# EAGLE design ShootingBoard (EAGLE 6.3)
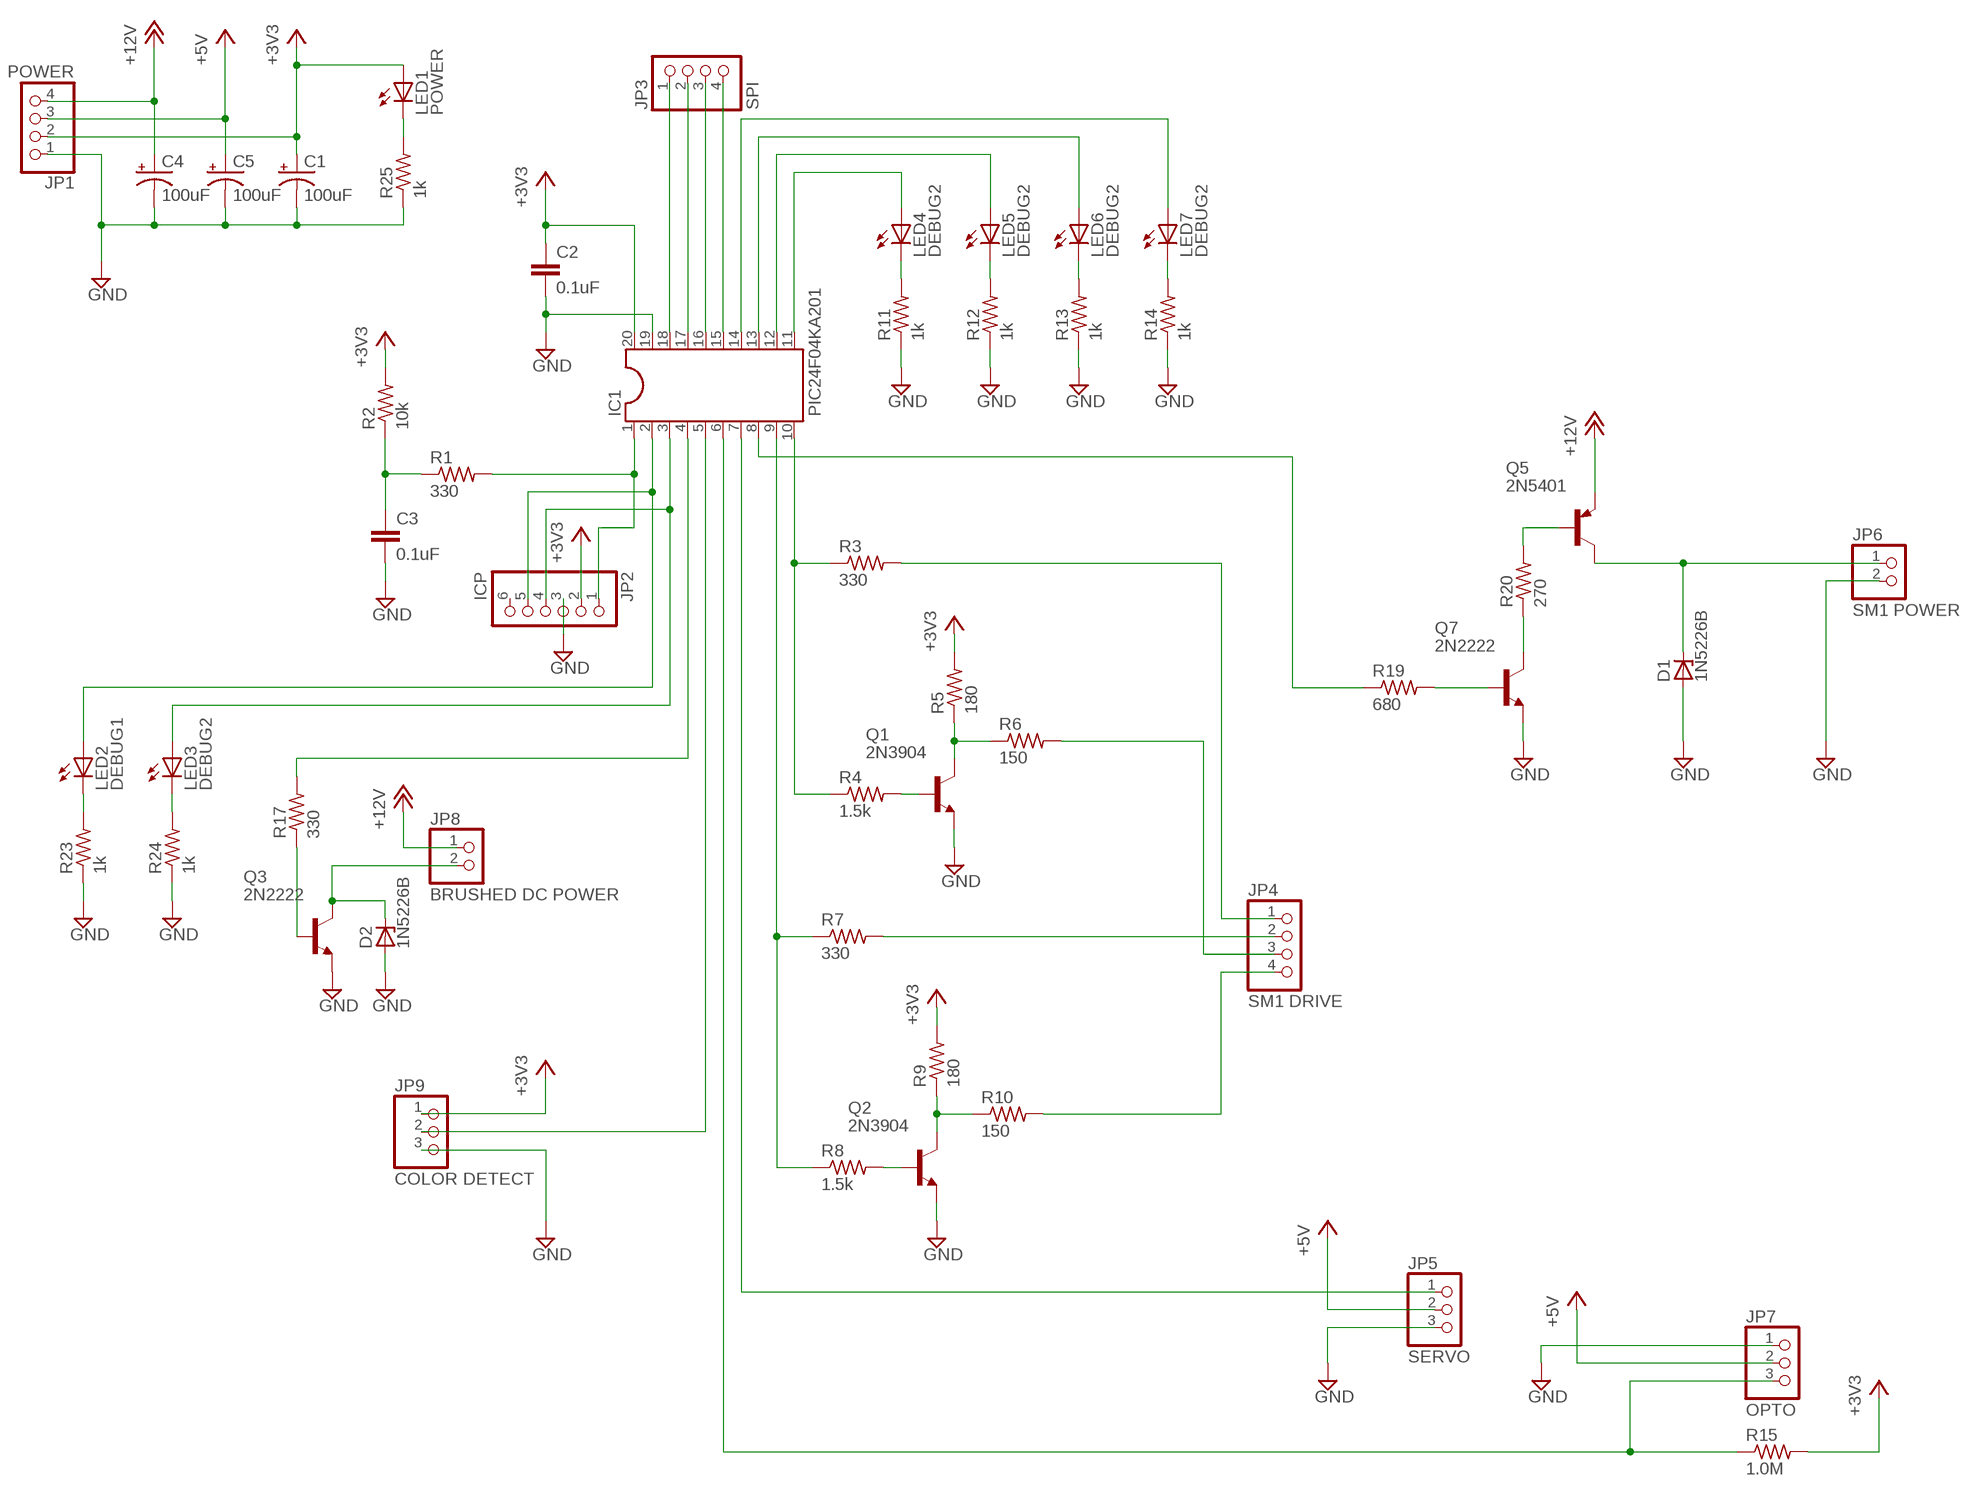
[diagram p0: schematic, sheet 1]

## Parts
C1  100uF  CPOL-USE2.5-7  [E2,5-7]
C2  0.1uF  C-EUC0805  [C0805]
C3  0.1uF  C-EUC0805  [C0805]
C4  100uF  CPOL-USE2.5-7  [E2,5-7]
C5  100uF  CPOL-USE2.5-7  [E2,5-7]
D1  1N5226B  ZPD  [DO35Z10]
D2  1N5226B  ZPD  [DO35Z10]
IC1  PIC24F04KA201  DIL20S  [SOCKET-20]
JP1  POWER  PINHD-1X4  [1X04]
JP2  ICP  PINHD-1X6  [1X06]
JP3  SPI  PINHD-1X4  [1X04]
JP4  SM1 DRIVE  PINHD-1X4  [1X04]
JP5  SERVO  PINHD-1X3  [1X03]
JP6  SM1 POWER  PINHD-1X2  [1X02]
JP7  OPTO  PINHD-1X3  [1X03]
JP8  BRUSHED DC POWER  PINHD-1X2  [1X02]
JP9  COLOR DETECT  PINHD-1X3  [1X03]
LED1  POWER  LED3MM  [LED3MM]
LED2  DEBUG1  LED3MM  [LED3MM]
LED3  DEBUG2  LED3MM  [LED3MM]
LED4  DEBUG2  LED3MM  [LED3MM]
LED5  DEBUG2  LED3MM  [LED3MM]
LED6  DEBUG2  LED3MM  [LED3MM]
LED7  DEBUG2  LED3MM  [LED3MM]
Q1  2N3904  [TO92]
Q2  2N3904  [TO92]
Q3  2N2222  2N3904  [TO92]
Q5  2N5401  2N3906  [TO92]
Q7  2N2222  2N3904  [TO92]
R1  330  R-US_R0805  [R0805]
R2  10k  R-US_R0805  [R0805]
R3  330  R-US_R0805  [R0805]
R4  1.5k  R-US_R0805  [R0805]
R5  180  R-US_R0805  [R0805]
R6  150  R-US_R0805  [R0805]
R7  330  R-US_R0805  [R0805]
R8  1.5k  R-US_R0805  [R0805]
R9  180  R-US_R0805  [R0805]
R10  150  R-US_R0805  [R0805]
R11  1k  R-US_R0805  [R0805]
R12  1k  R-US_R0805  [R0805]
R13  1k  R-US_R0805  [R0805]
R14  1k  R-US_R0805  [R0805]
R15  1.0M  R-US_R0805  [R0805]
R17  330  R-US_R0805  [R0805]
R19  680  R-US_R0805  [R0805]
R20  270  R-US_R0805  [R0805]
R23  1k  R-US_R0805  [R0805]
R24  1k  R-US_R0805  [R0805]
R25  1k  R-US_R0805  [R0805]

## Nets
+3V3: C1.+ C2.1 IC1.20 JP1.2 JP2.2 JP9.1 LED1.A R2.2 R5.2 R9.2 R15.2
+5V: C5.+ JP1.3 JP5.2 JP7.2
+12V: C4.+ JP1.4 JP8.1 Q5.3(E)
GND: C1.- C2.2 C3.2 C4.- C5.- D1.A D2.A IC1.19 JP1.1 JP2.3 JP5.3 JP6.2 JP7.1 JP9.3 Q1.3(E) Q2.3(E) Q3.3(E) Q7.3(E) R11.1 R12.1 R13.1 R14.1 R23.1 R24.1 R25.1
N$1: IC1.1 JP2.1 R1.2
N$2: C3.1 R1.1 R2.1
N$3: IC1.2 JP2.5 LED2.A
N$4: IC1.3 JP2.4 LED3.A
N$5: IC1.10 R3.1 R4.1
N$6: Q1.1(C) R5.1 R6.1
N$7: Q1.2(B) R4.2
N$8: IC1.9 R7.1 R8.1
N$9: Q2.1(C) R9.1 R10.1
N$10: Q2.2(B) R8.2
N$11: IC1.11 LED4.A
N$12: LED4.K(C) R11.2
N$13: IC1.12 LED5.A
N$14: LED5.K(C) R12.2
N$15: IC1.13 LED6.A
N$16: LED6.K(C) R13.2
N$17: JP4.1 R3.2
N$18: JP4.2 R7.2
N$19: JP4.3 R6.2
N$20: JP4.4 R10.2
N$21: IC1.14 LED7.A
N$22: LED7.K(C) R14.2
N$23: IC1.6 JP7.3 R15.1
N$24: IC1.5 JP9.2
N$25: IC1.4 R17.2
N$26: Q7.1(C) R20.1
N$27: Q5.2(B) R20.2
N$28: D1.C JP6.1 Q5.1(C)
N$29: D2.C JP8.2 Q3.1(C)
N$30: IC1.7 JP5.1
N$31: Q7.2(B) R19.2
N$32: Q3.2(B) R17.1
N$33: IC1.8 R19.1
N$34: IC1.18 JP3.1
N$35: IC1.17 JP3.2
N$36: IC1.16 JP3.3
N$37: IC1.15 JP3.4
N$38: LED2.K(C) R23.2
N$39: LED3.K(C) R24.2
N$40: LED1.K(C) R25.2
Unconnected: JP2.6

## Library data of the parts
C1 C4 C5 = rcl:CPOL-US: POLARIZED CAPACITOR, American symbol
C2 C3 = rcl:C-EU: CAPACITOR, European symbol
D1 D2 = diode:ZPD: Z DIODE 500 mW
IC1 = ic-package:DIL20: Dual In Line / Socket
JP1 JP3 JP4 = pinhead:PINHD-1X4: PIN HEADER
JP2 = pinhead:PINHD-1X6: PIN HEADER
JP5 JP7 JP9 = pinhead:PINHD-1X3: PIN HEADER
JP6 JP8 = pinhead:PINHD-1X2: PIN HEADER
LED1-LED7 = led:LED: LED OSRAM: - CHIPLED LG R971, LG N971, LY N971, LG Q971, LY Q971, LO R971, LY R971 LH N974, LH R974 LS Q976, LO Q976, LY Q976 LO Q996 - Hyper CHIPLED LW Q18S LB Q993, LB Q99A, LB R99A - SideLED LS A670, LO A670, LY A670, LG A670, LP A670 LB A673, LV A673, LT A673, LW A673 LH A674 LY A675 LS A676, LA A676, LO A676, LY A676, LW A676 LS A679, LY A679, LG A679 - Hyper Micro SIDELED® LS Y876, LA Y876, LO Y876, LY Y876 LT Y87S - SmartLED LW L88C, LW L88S LB L89C, LB L89S, LG L890 LS L89K, LO L89K, LY L89K LS L896, LA L896, LO L896, LY L896 - TOPLED LS T670, LO T670, LY T670, LG T670, LP T670 LSG T670, LSP T670, LSY T670, LOP T670, LYG T670 LG T671, LOG T671, LSG T671 LB T673, LV T673, LT T673, LW T673 LH T674 LS T676, LA T676, LO T676, LY T676, LB T676, LH T676, LSB T676, LW T676 LB T67C, LV T67C, LT T67C, LS T67K, LO T67K, LY T67K, LW E67C LS E67B, LA E67B, LO E67B, LY E67B, LB E67C, LV E67C, LT E67C LW T67C LS T679, LY T679, LG T679 LS T770, LO T770, LY T770, LG T770, LP T770 LB T773, LV T773, LT T773, LW T773 LH T774 LS E675, LA E675, LY E675, LS T675 LS T776, LA T776, LO T776, LY T776, LB T776 LHGB T686 LT T68C, LB T68C - Hyper Mini TOPLED® LB M676 - Mini TOPLED Santana® LG M470 LS M47K, LO M47K, LY M47K Source: http://www.osram.convergy.de LUXEON: - LUMILED® LXK2-PW12-R00, LXK2-PW12-S00, LXK2-PW14-U00, LXK2-PW14-V00 LXK2-PM12-R00, LXK2-PM12-S00, LXK2-PM14-U00 LXK2-PE12-Q00, LXK2-PE12-R00, LXK2-PE12-S00, LXK2-PE14-T00, LXK2-PE14-U00 LXK2-PB12-K00, LXK2-PB12-L00, LXK2-PB12-M00, LXK2-PB14-N00, LXK2-PB14-P00, LXK2-PB14-Q00 LXK2-PR12-L00, LXK2-PR12-M00, LXK2-PR14-Q00, LXK2-PR14-R00 LXK2-PD12-Q00, LXK2-PD12-R00, LXK2-PD12-S00 LXK2-PH12-R00, LXK2-PH12-S00 LXK2-PL12-P00, LXK2-PL12-Q00, LXK2-PL12-R00 Source: www.luxeon.com KINGBRIGHT: KA-3528ASYC Source: www.kingbright.com
Q1-Q3 Q7 = transistor-npn:2N3904: NPN Transistor
Q5 = transistor-pnp:2N3906: PNP Transistor
R1-R15 R17 R19 R20 R23-R25 = rcl:R-US_: RESISTOR, American symbol

## Board
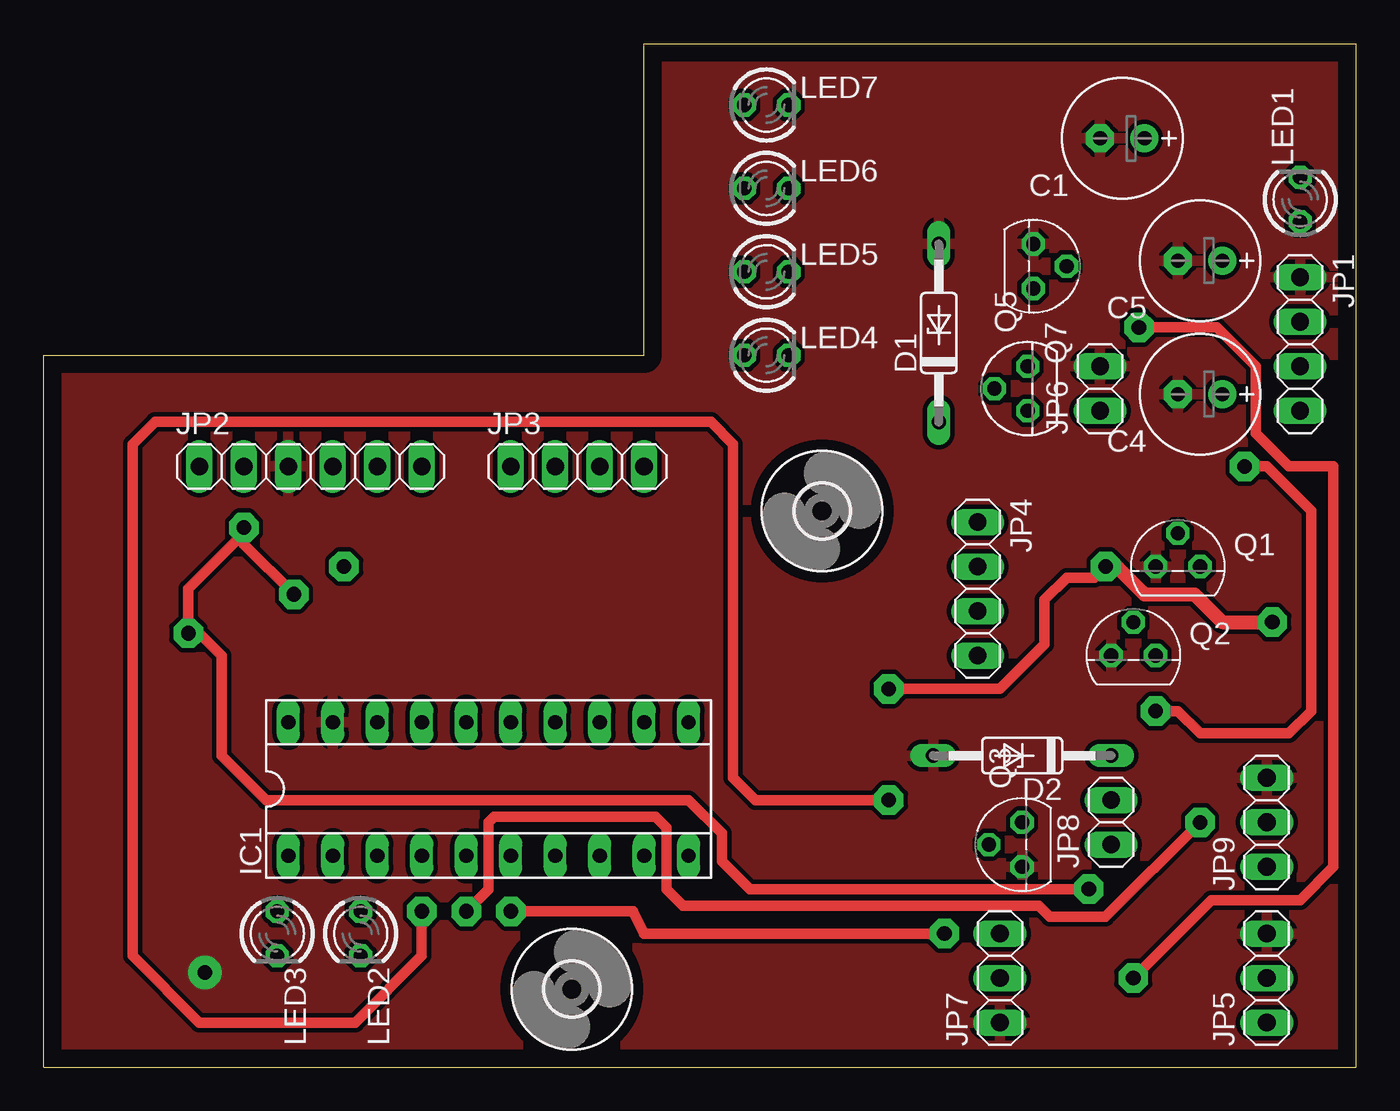
[diagram p1: board, top side]
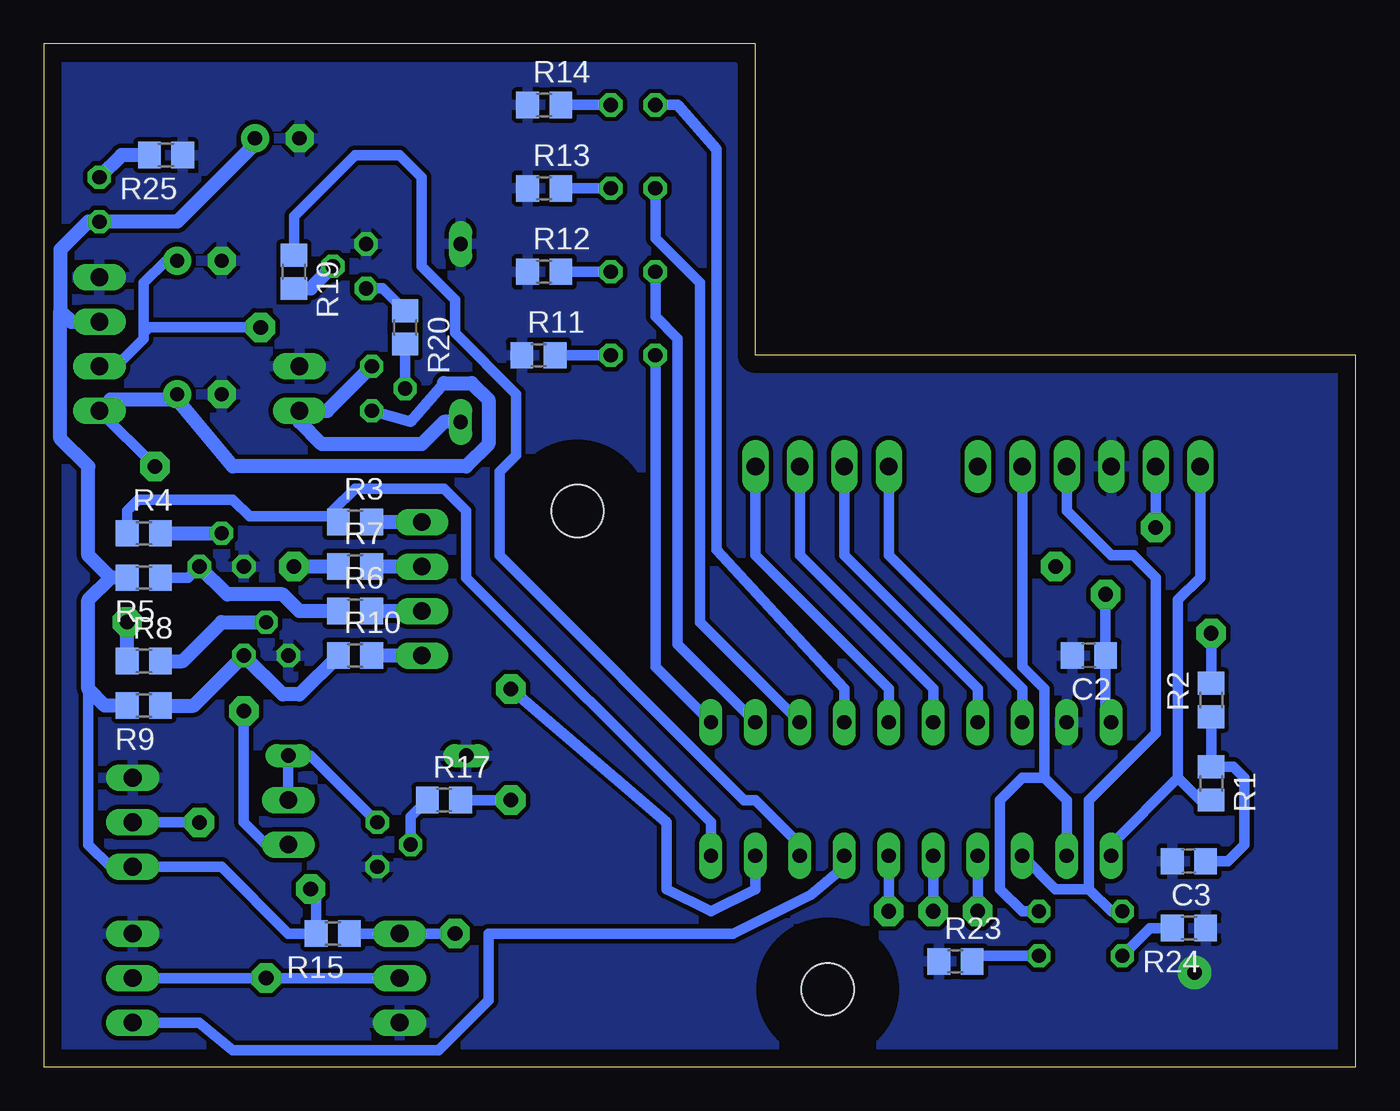
[diagram p2: board, bottom side, seen from below]

Size 74.93 x 58.42 mm. Coordinates in mm from the lower left corner, seen from the top.
Outline: 0,0 74.93,0 74.93,58.42 34.29,58.42 34.29,40.64 0,40.64 0,0
Copper layers (1*16): Top 0.035mm / dielectric 1.5mm / Bottom 0.035mm
Design rules "default *": minimum track width 10mil, minimum drill 24mil, track to track 10mil, track to pad 10mil, pad to pad 10mil, via to via 10mil, smd to smd 8mil, copper to edge 40mil, drill to drill 8mil, minimum pad ring 10mil, minimum via ring 8mil, stop-mask expansion 4mil, vias tented up to drill 0mil, thermal gap 10mil

### Footprints (pad centres in the part's own frame; a part is rotated, then mirrored left to right if it is on the bottom)
E2,5-7 = drill 0.813 pad 1.6: + -1.27,0 | drill 0.813 pad 1.6 octagon: - 1.27,0
C0805 = smd 1.3 x 1.5: 1 -0.95,0; 2 0.95,0
DO35Z10 = drill 0.813 long: A 5.08,0; C -5.08,0
SOCKET-20 = drill 0.813 long: 1 -11.43,-3.81; 2 -8.89,-3.81; 3 -6.35,-3.81; 4 -3.81,-3.81; 5 -1.27,-3.81; 6 1.27,-3.81; 7 3.81,-3.81; 8 6.35,-3.81; 9 8.89,-3.81; 10 11.43,-3.81; 11 11.43,3.81; 12 8.89,3.81; 13 6.35,3.81; 14 3.81,3.81; 15 1.27,3.81; 16 -1.27,3.81; 17 -3.81,3.81; 18 -6.35,3.81; 19 -8.89,3.81; 20 -11.43,3.81
1X04 = drill 1.016 long: 1 -3.81,0; 2 -1.27,0; 3 1.27,0; 4 3.81,0
1X06 = drill 1.016 long: 1 -6.35,0; 2 -3.81,0; 3 -1.27,0; 4 1.27,0; 5 3.81,0; 6 6.35,0
1X03 = drill 1.016 long: 1 -2.54,0; 2 0,0; 3 2.54,0
1X02 = drill 1.016 long: 1 -1.27,0; 2 1.27,0
LED3MM = drill 0.813 octagon: A -1.27,0; K 1.27,0
TO92 = drill 0.813 octagon: 1 1.27,0; 2 0,1.905; 3 -1.27,0
R0805 = smd 1.3 x 1.5: 1 -0.95,0; 2 0.95,0
3,0 = hole 3: 0,0

### Placement (x,y rotation side)
C1  61.59,53.02 180 top
C2  15.24,23.5 180 bottom
C3  9.53,11.75 180 bottom
C4  66.04,38.42 180 top
C5  66.04,46.04 180 top
D1  51.12,41.91 90 top
D2  55.88,17.78 180 top
IC1  25.4,15.88 0 top
JP1  71.75,41.27 270 top
JP2  15.24,34.29 0 top
JP3  30.48,34.29 0 top
JP4  53.34,27.3 270 top
JP5  69.85,5.08 90 top
JP6  60.33,38.73 90 top
JP7  54.61,5.08 90 top
JP8  60.96,13.97 90 top
JP9  69.85,13.97 90 top
LED1  71.75,49.53 90 top
LED2  18.1,7.62 270 top
LED3  13.34,7.62 270 top
LED4  41.27,40.64 0 top
LED5  41.27,45.4 0 top
LED6  41.27,50.16 0 top
LED7  41.27,54.93 0 top
Q1  64.77,28.57 0 top
Q2  62.23,23.5 0 top
Q3  55.88,12.7 90 top
Q5  56.2,38.73 90 top
Q7  56.52,45.72 270 top
R1  8.26,16.19 270 bottom
R2  8.26,20.95 90 bottom
R3  57.15,31.11 0 bottom
R4  69.22,30.48 0 bottom
R5  69.22,27.94 180 bottom
R6  57.15,26.04 0 bottom
R7  57.15,28.57 0 bottom
R8  69.22,23.18 0 bottom
R9  69.22,20.64 180 bottom
R10  57.15,23.5 0 bottom
R11  46.67,40.64 0 bottom
R12  46.35,45.4 0 bottom
R13  46.35,50.16 0 bottom
R14  46.35,54.93 0 bottom
R15  58.42,7.62 180 bottom
R17  52.07,15.24 0 bottom
R19  60.64,45.4 270 bottom
R20  54.29,42.23 270 bottom
R23  22.86,6.03 0 bottom
R24  9.53,7.94 180 bottom
R25  67.94,52.07 180 bottom
U$1  [3,0]  44.45,31.75 0 top
U$2  [3,0]  30.16,4.45 0 top

### Tracks (layer width: path | path; a pad name or v marks a point on that pad's centre or on a via)
+3V3  (via drill 0.84 pad 1.68)
  Top 0.61: v11.43,30.8 11.43,30.48 | 11.43,30.48 11.43,29.84 v14.29,26.99 | v8.26,24.77 8.26,25.4 | 8.26,25.4 8.26,27.3 11.43,30.48 | v59.69,10.16 40.32,10.16 38.73,11.75 38.73,13.34 36.83,15.24 12.7,15.24 10.16,17.78 10.16,23.5 8.26,25.4
  Bottom 0.61: JP2.2 v11.43,30.8 | IC1.20 14.29,20 C2.1 v14.29,26.99 | 72.39,21.59 72.39,12.7 71.12,11.43 JP9.1 64.77,11.43 60.96,7.62 R15.2 59.37,9.84 v59.69,10.16 | R2.2 v8.26,24.77
  Bottom 0.813: C1.+ 62.87,52.7 67.31,48.26 LED1.A 72.39,48.26 73.98,46.67 73.98,43.18 | 73.98,43.18 73.34,42.55 JP1.2 | R9.2 71.44,20.64 72.39,21.59 72.39,26.67 71.12,27.94 | R5.2 71.12,27.94 | 71.12,27.94 72.39,29.21 72.39,34.29 73.98,35.88 73.98,43.18
+5V  (via drill 0.84 pad 1.68)
  Top 0.61: v62.55,42.23 66.99,42.23 69.22,40.01 69.22,36.2 71.12,34.29 73.66,34.29 73.66,11.43 71.75,9.53 66.67,9.53 v62.23,5.08
  Bottom 0.61: C5.+ 67.94,46.04 69.22,44.77 69.22,41.91 | 69.22,41.91 69.22,41.59 70.8,40.01 | v62.55,42.23 68.9,42.23 69.22,41.91 | JP7.2 v62.23,5.08 JP5.2
  Bottom 0.813: 70.8,40.01 JP1.3
+12V  (via drill 0.84 pad 1.68)
  Top 0.61: v63.5,20.32 64.77,20.32 66.04,19.05 71.12,19.05 72.39,20.32 72.39,31.75 69.85,34.29 v68.58,34.29
  Bottom 0.61: Q5.3 53.98,36.83 52.07,39.05 | JP8.1 62.23,12.7 63.5,13.97 v63.5,20.32 | JP1.4 v68.58,34.29
  Bottom 0.813: 52.07,39.05 50.48,39.05 49.53,38.1 49.53,35.56 50.8,34.29 64.14,34.29 67.31,38.1 | C4.+ 67.31,38.1 | 67.31,38.1 71.12,38.1 JP1.4
GND  (via drill 0.84 pad 1.93)
  other vias: 9.21,5.4
  pour Bottom: 0,40.64 0,0 76.2,0 76.2,57.15 35.56,57.15 35.56,40.64
  pour Top: -2.54,41.91 -2.54,-3.81 78.74,-3.81 78.74,58.42 33.02,58.42 33.02,41.91
N$1
  Bottom 0.61: JP2.1 8.89,27.94 10.16,26.67 10.16,16.51 | 10.16,16.51 8.89,15.24 R1.2 | IC1.1 13.97,12.7 10.16,16.51
N$2
  Bottom 0.61: R2.1 R1.1 6.99,17.14 6.35,16.51 6.35,12.7 7.3,11.75 C3.1
N$3
  Bottom 0.61: IC1.2 16.51,15.24 17.78,16.51 | 17.78,16.51 19.05,16.51 20.32,15.24 20.32,10.16 19.05,8.89 LED2.A | JP2.5 19.05,22.86 17.78,21.59 17.78,16.51
N$4
  Bottom 0.61: JP2.4 16.51,31.75 13.97,29.21 12.7,29.21 11.43,27.94 11.43,19.05 15.24,15.24 15.24,10.16 | 15.24,10.16 13.97,8.89 LED3.A | IC1.3 17.14,10.16 15.24,10.16
N$5
  Bottom 0.61: IC1.10 36.83,13.97 50.8,27.94 50.8,31.75 52.07,33.02 57.15,33.02 58.42,31.75 58.42,31.43 | 58.42,31.43 R3.1 | 58.42,31.43 63.19,31.43 64.14,32.38 69.53,32.38 70.17,31.75 R4.1
N$6
  Bottom 0.61: R5.1 66.67,27.94 Q1.1
  Bottom 0.813: R6.1 60.33,26.04 61.28,26.99 64.45,26.99 Q1.1
N$7
  Bottom 0.813: R4.2 Q1.2
N$8  (via drill 0.84 pad 1.68)
  Top 0.61: v48.26,21.59 54.61,21.59 57.15,24.13 57.15,26.67 58.42,27.94 60.01,27.94 v60.64,28.57
  Top 0.813: v60.64,28.57 61.28,28.57 62.87,26.99 65.72,26.99 67.31,25.4 v70.17,25.4
  Bottom 0.61: IC1.9 34.29,10.16 36.83,8.89 39.37,10.16 39.37,13.97 v48.26,21.59
  Bottom 0.813: R7.1 v60.64,28.57 | R8.1 v70.17,25.4
N$9
  Bottom 0.813: R10.1 60.33,21.27 61.28,21.27 Q2.1 66.36,20.64 R9.1
N$10
  Bottom 0.813: R8.2 66.99,23.18 64.77,25.4 Q2.2
N$11
  Bottom 0.61: LED4.A 40.01,22.86 IC1.11
N$12
  Bottom 0.61: LED4.K R11.2
N$13
  Bottom 0.61: LED5.A 40.01,42.86 38.73,41.59 38.73,24.13 IC1.12
N$14
  Bottom 0.61: R12.2 LED5.K
N$15
  Bottom 0.61: LED6.A 40.01,47.31 37.47,44.77 37.47,25.4 IC1.13
N$16
  Bottom 0.61: LED6.K R13.2
N$17
  Bottom 0.813: JP4.1 R3.2
N$18
  Bottom 0.813: JP4.2 R7.2
N$19
  Bottom 0.813: JP4.3 R6.2
N$20
  Bottom 0.813: JP4.4 R10.2
N$21
  Bottom 0.61: LED7.A 38.73,54.93 36.51,52.39 36.51,29.53 29.21,21.59 IC1.14
N$22
  Bottom 0.61: LED7.K R14.2
N$23  (via drill 0.84 pad 1.68)
  Top 0.61: v26.67,8.89 33.66,8.89 34.29,7.62 v51.44,7.62
  Bottom 0.61: IC1.6 v26.67,8.89 | v51.44,7.62 JP7.3 R15.1
N$24  (via drill 0.84 pad 1.68)
  Top 0.61: v66.04,13.97 60.64,8.57 57.47,8.57 56.83,9.21 36.51,9.21 35.56,10.16 35.56,13.65 34.92,14.29 25.72,14.29 25.4,13.97 25.4,10.16 v24.13,8.89
  Bottom 0.61: IC1.5 v24.13,8.89 | JP9.2 v66.04,13.97
N$25  (via drill 0.84 pad 1.68)
  Top 0.61: v48.26,15.24 40.64,15.24 39.37,16.51 39.37,35.56 38.1,36.83 6.35,36.83 5.08,35.56 5.08,6.35 8.89,2.54 17.78,2.54 21.59,6.35 v21.59,8.89
  Bottom 0.61: IC1.4 v21.59,8.89 | v48.26,15.24 R17.2
N$26
  Bottom 0.61: Q7.1 55.56,44.45 R20.1
N$27
  Bottom 0.61: R20.2 Q5.2
N$28
  Bottom 0.813: Q5.1 58.74,37.47 JP6.1 60.33,36.83 59.05,35.56 53.34,35.56 52.07,36.83 D1.C
N$29
  Bottom 0.61: JP8.2 D2.C 59.69,17.78 Q3.1
N$30
  Bottom 0.61: IC1.7 29.21,11.43 31.11,9.84 35.56,7.62 49.53,7.62 49.53,3.81 52.39,0.95 64.14,0.95 66.04,2.54 JP5.1
N$31
  Bottom 0.813: R19.2 59.69,44.45 Q7.2
N$32
  Bottom 0.61: Q3.2 53.98,14.29 R17.1
N$33
  Bottom 0.61: IC1.8 31.75,12.7 34.29,15.24 34.92,15.24 48.9,29.21 48.9,33.97 47.94,34.92 47.94,38.42 51.44,41.91 51.44,43.81 53.34,45.72 53.34,50.8 54.61,52.07 57.15,52.07 60.64,48.58 R19.1
N$34
  Bottom 0.61: IC1.18 19.05,21.59 26.67,29.21 JP3.1
N$35
  Bottom 0.61: IC1.17 21.59,21.59 29.21,29.21 JP3.2
N$36
  Bottom 0.61: JP3.3 31.75,29.21 24.13,21.59 IC1.16
N$37
  Bottom 0.61: IC1.15 26.67,21.59 34.29,29.21 JP3.4
N$38
  Bottom 0.61: LED2.K 21.59,6.35 R23.2
N$39
  Bottom 0.61: R24.2 11.75,7.94 LED3.K
N$40
  Bottom 0.813: R25.2 70.48,52.07 LED1.K
N$44  (via drill 0.84 pad 1.68)
  other vias: 17.14,28.57